# EAGLE design v1.0_r2 (EAGLE 9.6.2)
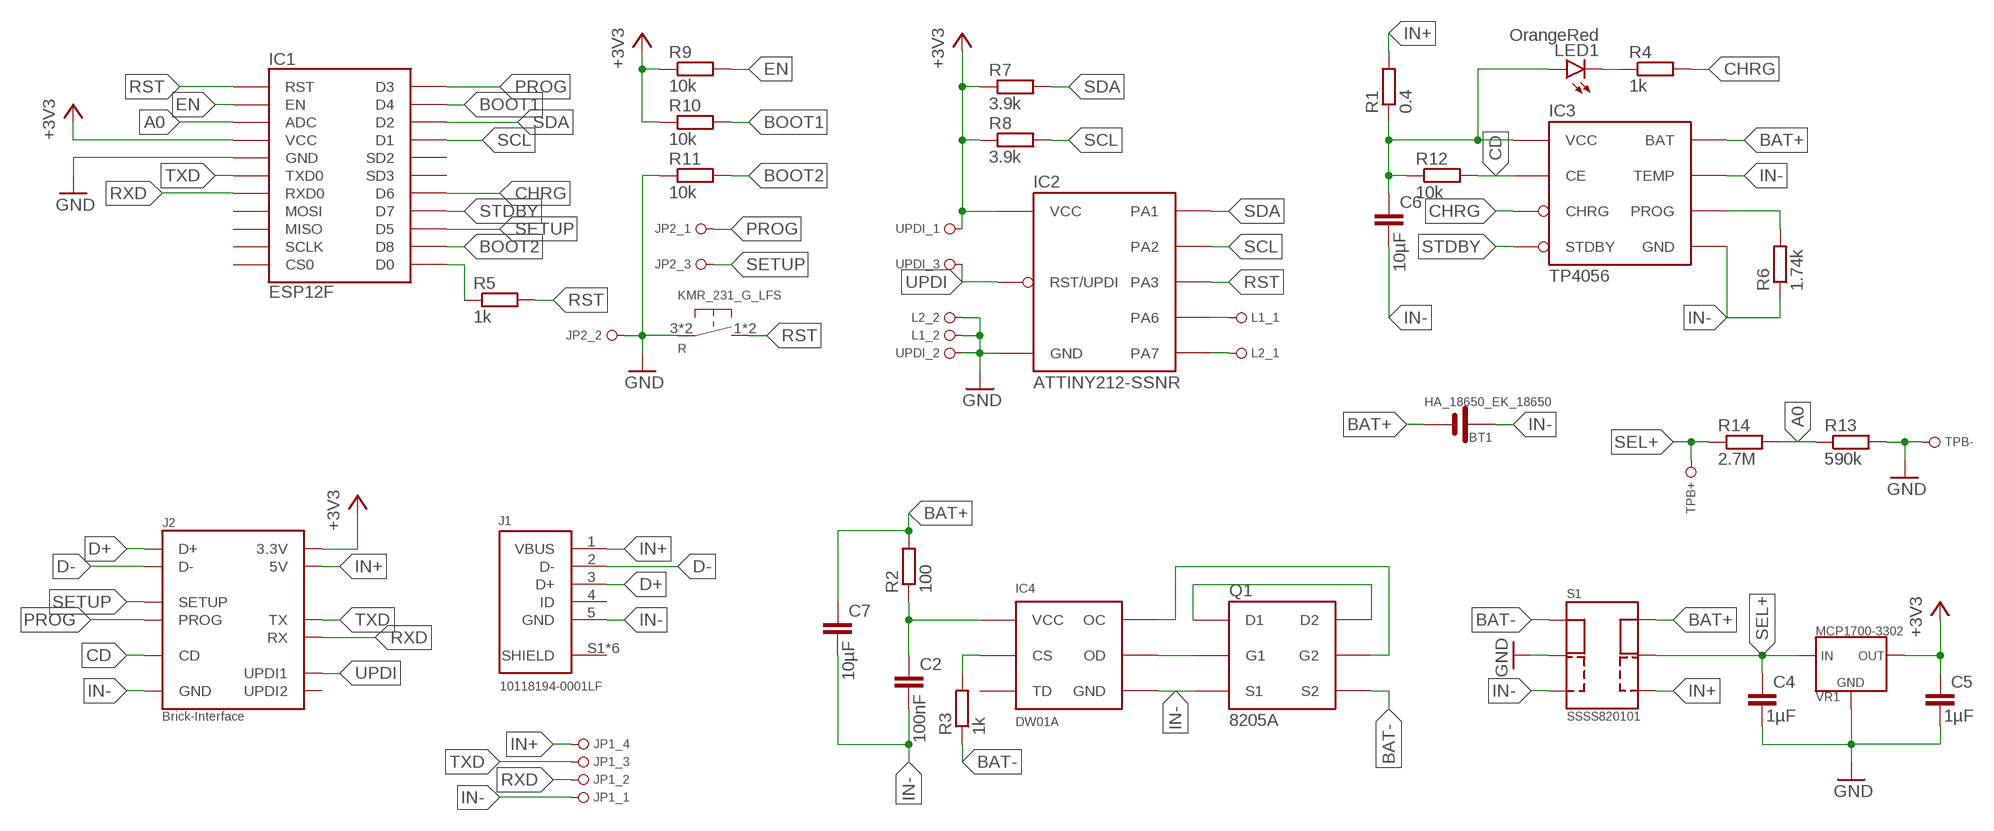
[diagram p0: schematic, sheet 1]

## Parts
BT1  HA_18650_EK_18650  [HA_18650_EK_18650]
C2  100nF  C-EUC0805  [C0805]
C4  1µF  C-EUC0805  [C0805]
C5  1µF  C-EUC0805  [C0805]
C6  10µF  C-EUC0805  [C0805]
C7  10µF  C-EUC0805  [C0805]
IC1  ESP12F  [ESP12]
IC2  ATTINY212-SSNR  [SOIC8]
IC3  TP4056  [SO8-THERMALPAD]
IC4  DW01A  [SOT23-6]
J1  10118194-0001LF  [10118194-0001LF]
J2  Brick-Interface  NAHS-BRICK-INTERFACE_B-SIDE  [500334-0160]
JP1  PINHD_1X04_R_1  [1X04_R_1]
JP2  PINHD_1X03_R_1  [1X03_R_1]
L1  PINHD_1X02_R_1  [1X02_R_1]
L2  PINHD_1X02_R_1  [1X02_R_1]
LED1  OrangeRed  LEDCHIP-LED0805  [CHIP-LED0805]
Q1  8205A  [TSSOP8]
R  KMR_231_G_LFS  [KMR_231_G_LFS]
R1  0.4  R-EU_R0805  [R0805]
R2  100  R-EU_R0805  [R0805]
R3  1k  R-EU_R0805  [R0805]
R4  1k  R-EU_R0805  [R0805]
R5  1k  R-EU_R0805  [R0805]
R6  1.74k  R-EU_R0805  [R0805]
R7  3.9k  R-EU_R0805  [R0805]
R8  3.9k  R-EU_R0805  [R0805]
R9  10k  R-EU_R0805  [R0805]
R10  10k  R-EU_R0805  [R0805]
R11  10k  R-EU_R0805  [R0805]
R12  10k  R-EU_R0805  [R0805]
R13  590k  R-EU_R0805  [R0805]
R14  2.7M  R-EU_R0805  [R0805]
S1  SSSS820101  [SSSS820101]
TPB+  PINHD_1X01_S_0.8  [1X01_S_0.8]
TPB-  PINHD_1X01_S_0.8  [1X01_S_0.8]
UPDI  PINHD_1X03_R_1  [1X03_R_1]
VR1  MCP1700-3302  [SOT23]

## Nets
+3V3: C5.1 IC1.VCC IC2.1(VCC) J2.16(3.3V) R7.1 R8.1 R9.1 R10.1 UPDI.1 VR1.2(OUT)
A0: IC1.ADC R13.1 R14.2
BAT+: BT1.P1(PLUS) BT1.P2(PLUS) BT1.P3(PLUS) C7.1 IC3.5(BAT) R2.2 S1.6
BAT-: Q1.6(S2) Q1.7(S2) R3.1 S1.3
BOOT1: IC1.GPIO2(D4) R10.2
BOOT2: IC1.GPIO15(D8) R11.2
CD: IC3.8(CE) J2.13(CD) R12.2
CHRG: IC1.GPIO12(D6) IC3.7(CHRG) R4.2
D+: J1.3(D+) J2.9(D+)
D-: J1.2(D-) J2.10(D-)
EN: IC1.EN R9.2
GND: C4.2 C5.2 IC1.GND IC2.8(GND) JP2.2 L1.2 L2.2 R11.1 R13.2 R.3 R.4 S1.2 TPB-.1 UPDI.2 VR1.1(GND)
IN+: J1.1(VBUS) J2.5(5V) J2.6(5V) JP1.4 R1.2 S1.4
IN-: BT1.M1(MINUS) BT1.M2(MINUS) BT1.M3(MINUS) C2.2 C6.2 C7.2 IC3.1(TEMP) IC3.3(GND) IC3.T1(GND) IC3.T2(GND) IC3.T3(GND) IC3.T4(GND) IC3.T5(GND) IC3.T6(GND) IC3.T7(GND) IC3.T8(GND) IC4.6(GND) J1.5(GND) J2.11(GND) J2.12(GND) JP1.1 Q1.2(S1) Q1.3(S1) R6.1 S1.1
L1: IC2.2(PA6) L1.1
L2: IC2.3(PA7) L2.1
N$1: C6.1 IC3.4(VCC) LED1.A R1.1 R12.1
N$2: IC3.2(PROG) R6.2
N$3: IC4.2(CS) R3.2
N$4: C2.1 IC4.5(VCC) R2.1
N$7: LED1.C R4.1
N$8: IC4.1(OD) Q1.4(G1)
N$10: Q1.1(D1) Q1.8(D2)
N$11: IC4.3(OC) Q1.5(G2)
PROG: IC1.GPIO0(D3) J2.1(PROG) JP2.1
RST: IC1.RST IC2.7(PA3) R5.2 R.1 R.2
RXD: IC1.RXD0 J2.7(RX) JP1.2
SCL: IC1.GPIO5(D1) IC2.5(PA2) R8.2
SDA: IC1.GPIO4(D2) IC2.4(PA1) R7.2
SEL+: C4.1 R14.1 S1.5 TPB+.1 VR1.3(IN)
SETUP: IC1.GPIO14(D5) J2.2(SETUP) JP2.3
STDBY: IC1.GPIO13(D7) IC3.6(STDBY)
TXD: IC1.TXD0 J2.8(TX) JP1.3
UPDI: IC2.6(RST/UPDI) J2.15(UPDI1) UPDI.3
WAKE: IC1.GPIO16(D0) R5.1
Unconnected: IC1.CS0 IC1.GPIO9(SD2) IC1.GPIO10(SD3) IC1.MISO IC1.MOSI IC1.SCLK IC4.4(TD) J1.4(ID) J2.14(UPDI2)

## Power pins joined to a net without a drawn wire
SHIELD: J1.S1(SHIELD) J1.S2(SHIELD) J1.S3(SHIELD) J1.S4(SHIELD) J1.S5(SHIELD) J1.S6(SHIELD)

## Library data of the parts
BT1 = no_reichelt:HA_18650_EK
C2 C4-C7 = rcl:C-EU: CAPACITOR, European symbol; SPICEPREFIX: C
IC1 = no_expressif:ESP12
IC2 = no_microchip:ATTINY212
IC3 = no_reichelt:TP4056
IC4 = no_reichelt:DW01A
J1 = no_reichelt:10118194-0001LF: CONN RCPT USB2.0 MICRO B SMD R/A Manufacturer's datasheet <https://www.amphenol-icc.com/media/wysiwyg/files/drawing/10118194.pdf?__cf_chl_jschl_tk__=1e9b4569481076e99900b246ea640525553a7b60-1588047333-0-AZhEk6D50lwOf6CdaXmV1teudqMKHMxqtb1pEtnUtu77sOc-OVRjbCmHdORomVnr0W49D2E8XkcMdJ2SdWt5rDDYIblyJz7fSv-zilM8vQKAQDC1Z9aMVORhnMgYjPDuz8XpfDLul_eaqqFpemo1xIgoZv50WTuLMwu26ci7e02s9PWvR3z1cDqm9GMGYIPwIUd9yh5-TtN_o6DbEkadC7zoJlhYZSw-VEaYzfWnBSFg_n44fbEB3slHLR2YKLSiTmh8RSwpxKUP4gER0KeVoie9w-Ibtx3oKQbsZjrsPLGSu9BzV2nf3QeoErALCQuycvY9WhQdebLIpxaon6SXufpVIIdoKZHRpjuVVlAkUIr9oSIZGQzzOWY1-dWY48jVEOvnvoxw9-xup5uFcr7XWo0>; CREATED_BY: PCBLayout.com; DIGIKEY_PARTNO: 609-4618-2-ND; MANUFACTURER: Amphenol ICC (FCI); MPN: 10118194-0001LF
J2 = no_molex:NAHS-BRICK-INTERFACE: NAHS-Brick-Interface zum Programmieren und Konfigurieren von Bricks. B-SIDE Variant ist der Verbinder auf Brick-Seite I-SIDE Variant ist der Verbinder auf Interface-Seite
JP1 = no_pinhd:PINHD_1X04; DRILL: 1mm; PADSHAPE: round
JP2 UPDI = no_pinhd:PINHD_1X03; DRILL: 1mm; PADSHAPE: round
L1 L2 = no_pinhd:PINHD_1X02; DRILL: 1mm; PADSHAPE: round
LED1 = led:LED: LED OSRAM: - CHIPLED LG R971, LG N971, LY N971, LG Q971, LY Q971, LO R971, LY R971 LH N974, LH R974 LS Q976, LO Q976, LY Q976 LO Q996 - Hyper CHIPLED LW Q18S LB Q993, LB Q99A, LB R99A - SideLED LS A670, LO A670, LY A670, LG A670, LP A670 LB A673, LV A673, LT A673, LW A673 LH A674 LY A675 LS A676, LA A676, LO A676, LY A676, LW A676 LS A679, LY A679, LG A679 - Hyper Micro SIDELED® LS Y876, LA Y876, LO Y876, LY Y876 LT Y87S - SmartLED LW L88C, LW L88S LB L89C, LB L89S, LG L890 LS L89K, LO L89K, LY L89K LS L896, LA L896, LO L896, LY L896 - TOPLED LS T670, LO T670, LY T670, LG T670, LP T670 LSG T670, LSP T670, LSY T670, LOP T670, LYG T670 LG T671, LOG T671, LSG T671 LB T673, LV T673, LT T673, LW T673 LH T674 LS T676, LA T676, LO T676, LY T676, LB T676, LH T676, LSB T676, LW T676 LB T67C, LV T67C, LT T67C, LS T67K, LO T67K, LY T67K, LW E67C LS E67B, LA E67B, LO E67B, LY E67B, LB E67C, LV E67C, LT E67C LW T67C LS T679, LY T679, LG T679 LS T770, LO T770, LY T770, LG T770, LP T770 LB T773, LV T773, LT T773, LW T773 LH T774 LS E675, LA E675, LY E675, LS T675 LS T776, LA T776, LO T776, LY T776, LB T776 LHGB T686 LT T68C, LB T68C - Hyper Mini TOPLED® LB M676 - Mini TOPLED Santana® LG M470 LS M47K, LO M47K, LY M47K Source: http://www.osram.convergy.de LUXEON: - LUMILED® LXK2-PW12-R00, LXK2-PW12-S00, LXK2-PW14-U00, LXK2-PW14-V00 LXK2-PM12-R00, LXK2-PM12-S00, LXK2-PM14-U00 LXK2-PE12-Q00, LXK2-PE12-R00, LXK2-PE12-S00, LXK2-PE14-T00, LXK2-PE14-U00 LXK2-PB12-K00, LXK2-PB12-L00, LXK2-PB12-M00, LXK2-PB14-N00, LXK2-PB14-P00, LXK2-PB14-Q00 LXK2-PR12-L00, LXK2-PR12-M00, LXK2-PR14-Q00, LXK2-PR14-R00 LXK2-PD12-Q00, LXK2-PD12-R00, LXK2-PD12-S00 LXK2-PH12-R00, LXK2-PH12-S00 LXK2-PL12-P00, LXK2-PL12-Q00, LXK2-PL12-R00 Source: www.luxeon.com KINGBRIGHT: KA-3528ASYC Source: www.kingbright.com
Q1 = no_reichelt:8205A
R = no_reichelt:KMR_231_G_LFS
R1-R14 = rcl:R-EU_: RESISTOR, European symbol; SPICEPREFIX: R
S1 = no_reichelt:SSSS820101
TPB+ TPB- = no_pinhd:PINHD_1X01; DRILL: 0.8mm; PADSHAPE: square
VR1 = no_reichelt:MCP170

## Board
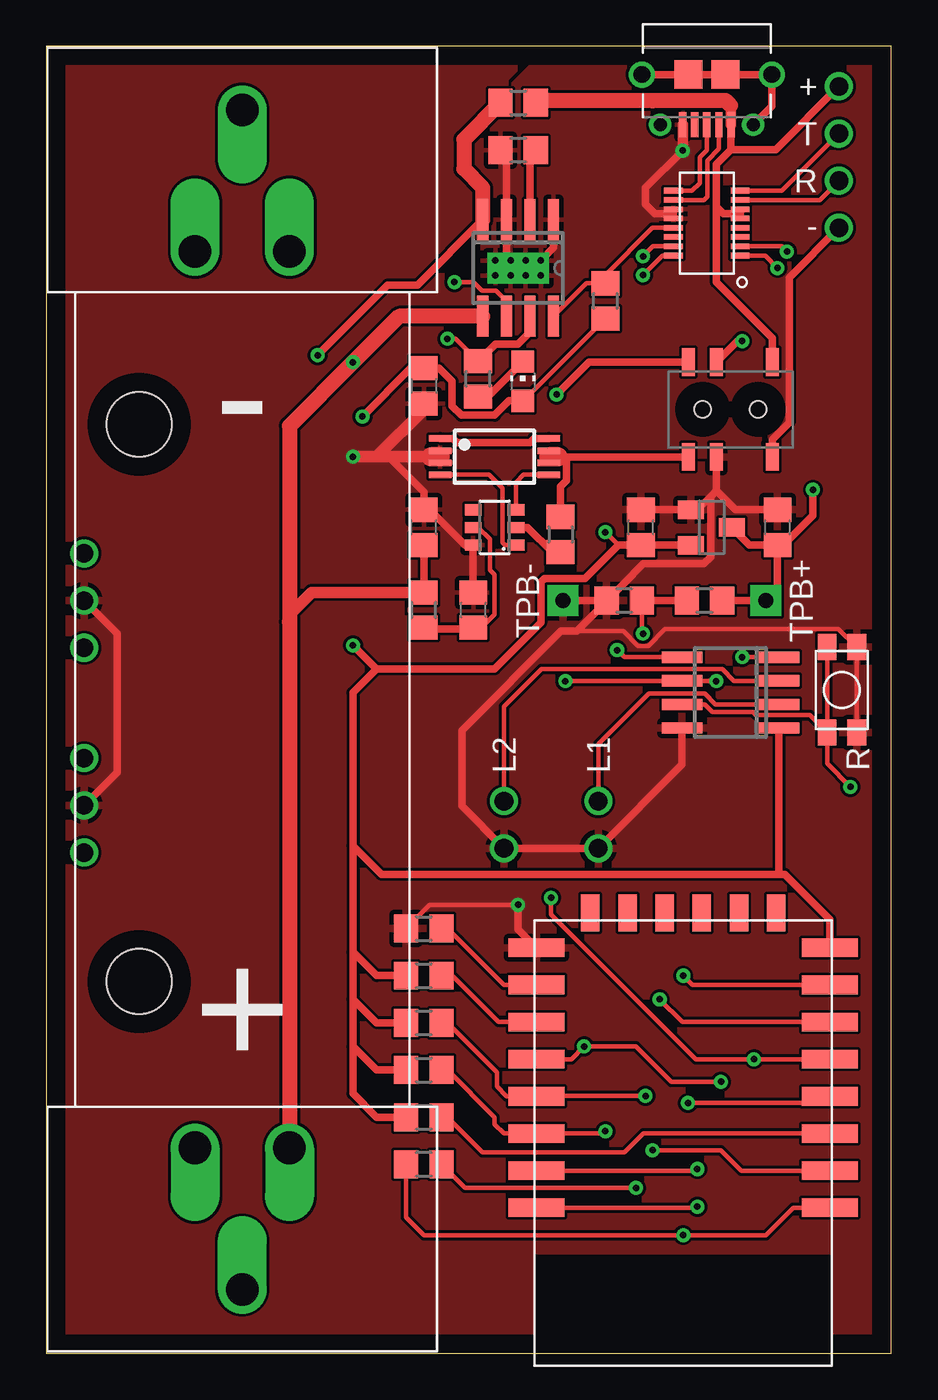
[diagram p1: board, top side]
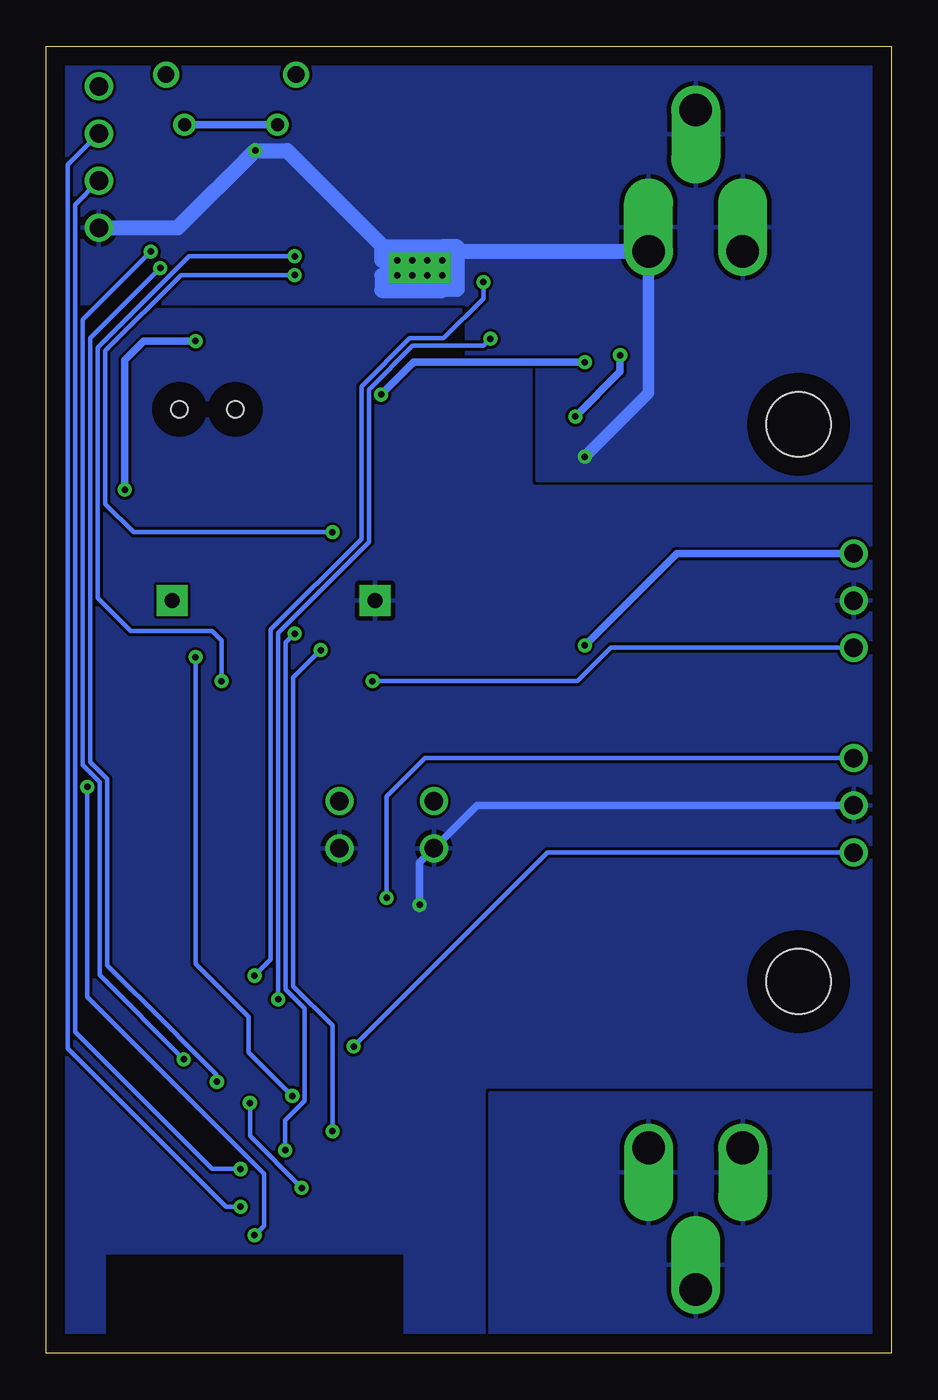
[diagram p2: board, bottom side, seen from below]

Size 45.5 x 70.35 mm. Coordinates in mm from the lower left corner, seen from the top.
Outline: 0,0 45.5,0 45.5,70.35 0,70.35 0,0
Copper layers (1*16): Top 0.035mm / dielectric 1.5mm / Bottom 0.035mm
Design rules "JLCPCB": minimum track width 6mil, minimum drill 0.3mm, track to track 6mil, track to pad 6mil, pad to pad 6mil, via to via 6mil, smd to smd 6mil, copper to edge 40mil, drill to drill 8mil, minimum pad ring 10mil, minimum via ring 8mil, stop-mask expansion 4mil, vias tented up to drill 0mil, thermal gap 10mil
Holes 3.5 mm at 5,20 5,50

### Footprints (pad centres in the part's own frame; a part is rotated, then mirrored left to right if it is on the bottom)
HA_18650_EK_18650 = drill 1.75 offset: M1 0,-30.48; M2 2.54,-22.86; M3 -2.54,-22.86; P1 0,33.02; P2 -2.54,25.4; P3 2.54,25.4
C0805 = smd 1.3 x 1.5: 1 -0.95,0; 2 0.95,0
ESP12 = smd 3 x 1: ADC -7.9,1.48; EN -7.9,-0.52; GND 7.9,-10.52; GPIO0 7.9,-4.52; GPIO2 7.9,-6.52; GPIO4 7.9,-2.52; GPIO5 7.9,-0.52; GPIO12 -7.9,-6.52; GPIO13 -7.9,-8.52; GPIO14 -7.9,-4.52; GPIO15 7.9,-8.52; GPIO16 -7.9,-2.52; RST -7.9,3.48; RXD0 7.9,1.48; TXD0 7.9,3.48; VCC -7.9,-10.52 | smd 1 x 2: CS0 -5,-12.4; GPIO9 -1,-12.4; GPIO10 1,-12.4; MISO -3,-12.4; MOSI 3,-12.4; SCLK 5,-12.4
SOIC8 = smd 0.6 x 2.2: 1 -1.905,-2.6; 2 -0.635,-2.6; 3 0.635,-2.6; 4 1.905,-2.6; 5 1.905,2.6; 6 0.635,2.6; 7 -0.635,2.6; 8 -1.905,2.6
SO8-THERMALPAD = smd 0.6 x 2.2: 1 -1.905,-2.6; 2 -0.635,-2.6; 3 0.635,-2.6; 4 1.905,-2.6; 5 1.905,2.6; 6 0.635,2.6; 7 -0.635,2.6; 8 -1.905,2.6 | drill 0.35 pad 0.813 square: T1 -1.219,0.406; T2 -0.406,0.406; T3 0.406,0.406; T4 1.219,0.406; T5 -1.219,-0.406; T6 -0.406,-0.406; T7 0.406,-0.406; T8 1.219,-0.406
SOT23-6 = smd 0.6 x 0.9: 1 -0.95,-1.15; 2 0,-1.15; 3 0.95,-1.15; 4 0.95,1.15; 5 0,1.15; 6 -0.95,1.15
10118194-0001LF = smd 0.4 x 1.35: 1 -1.3,2.7; 2 -0.65,2.7; 3 0,2.7; 4 0.65,2.7; 5 1.3,2.7 | drill 0.7: S1 -2.5,2.7; S2 2.5,2.7 | drill 0.9: S3 -3.5,0; S6 3.5,0 | smd 1.5 x 1.55: S4 -1,0; S5 1,0
500334-0160 = smd 0.3 x 1: 1 -1.75,-1.8; 2 -1.25,-1.8; 3 -0.75,-1.8; 4 -0.25,-1.8; 5 0.25,-1.8; 6 0.75,-1.8; 7 1.25,-1.8; 8 1.75,-1.8; 9 1.75,1.8; 10 1.25,1.8; 11 0.75,1.8; 12 0.25,1.8; 13 -0.25,1.8; 14 -0.75,1.8; 15 -1.25,1.8; 16 -1.75,1.8
1X04_R_1 = drill 1: 1 0,0; 2 2.54,0; 3 5.08,0; 4 7.62,0
1X03_R_1 = drill 1: 1 0,0; 2 2.54,0; 3 5.08,0
1X02_R_1 = drill 1: 1 0,0; 2 2.54,0
CHIP-LED0805 = smd 1.2 x 1.2: A 0,-1.05; C 0,1.05
TSSOP8 = smd 1.2 x 0.35: 1 -2.925,0.975; 2 -2.925,0.325; 3 -2.925,-0.325; 4 -2.925,-0.975; 5 2.925,-0.975; 6 2.925,-0.325; 7 2.925,0.325; 8 2.925,0.975
KMR_231_G_LFS = smd 1 x 1.4: 1 0,4.35; 2 0,-0.25; 3 1.6,-0.25; 4 1.6,4.35
R0805 = smd 1.3 x 1.5: 1 -0.95,0; 2 0.95,0
SSSS820101 = smd 1.5 x 0.7: 1 -2.55,-2.25; 2 -2.55,0.75; 3 -2.55,2.25; 4 2.55,-2.25; 5 2.55,0.75; 6 2.55,2.25 | hole 0.9: 0,1.5; 0,-1.5
1X01_S_0.8 = drill 0.8 pad 1.676 square: 1 0,0
SOT23 = smd 1 x 1.4: 1 -0.95,-1.1; 2 0.95,-1.1; 3 0,1.1

### Placement (x,y rotation side)
BT1  10.54,36.45 180 top
C2  22.99,40.01 90 top
C4  39.37,44.45 90 top
C5  32,44.45 90 top
C6  20.32,52.07 270 top
C7  20.32,44.45 90 top
IC1  34.29,11.3 180 top
IC2  36.83,35.56 90 top
IC3  25.4,58.42 180 top
IC4  24.13,44.45 90 top
J1  35.56,68.83 180 top
J2  35.56,60.83 90 top
JP1  42.67,60.58 90 top
JP2  2.03,26.95 90 top
L1  29.72,29.72 270 top
L2  24.64,29.72 270 top
LED1  25.65,52.32 0 top
Q1  24.13,48.26 0 top
R  42.04,33.66 0 top
R1  25.4,67.31 0 top
R2  20.32,40.01 90 top
R3  27.69,44.07 270 top
R4  23.24,52.45 90 top
R5  20.32,10.16 180 top
R6  25.4,64.77 0 top
R7  20.32,17.78 0 top
R8  20.32,15.24 0 top
R9  20.32,12.7 0 top
R10  20.32,20.32 0 top
R11  20.32,22.86 0 top
R12  30.1,56.64 90 top
R13  31.11,40.51 180 top
R14  35.43,40.51 180 top
S1  36.83,50.8 90 top
TPB+  38.73,40.51 0 top
TPB-  27.81,40.51 0 top
UPDI  2.03,43.05 270 top
VR1  35.81,44.45 270 top

### Tracks (layer width: path | path; a pad name or v marks a point on that pad's centre or on a via)
+3V3  (via drill 0.35)
  Top 0.254: J2.16 33.17,59.08 v32.13,58.04 | 30.8,43.5 v30.1,44.2
  Top 0.406: 17.78,36.83 16.51,35.56 16.51,27.3 | 17.78,36.83 24.13,36.83 26.62,39.32 26.62,41.5 26.83,41.71 29.01,41.71 30.8,43.5 C5.1 VR1.2 | 39.37,25.78 39.75,25.78 42.19,23.34 IC1.VCC | 39.37,25.78 18.03,25.78 16.51,27.3 | R9.1 17.78,12.7 16.51,13.97 16.51,16.51 | 16.51,27.3 16.51,21.59 | 16.51,21.59 16.51,19.05 | 16.51,19.05 16.51,16.51 | R8.1 17.78,15.24 16.51,16.51 | R7.1 17.78,17.78 16.51,19.05 | R10.1 17.78,20.32 16.51,21.59 | 17.78,36.83 v16.51,38.1 | IC2.1 39.43,25.84 39.37,25.78
  Bottom 0.254: v32.13,58.04 38.25,58.04 42.33,53.96 42.33,45.72 40.8,44.2 v30.1,44.2
  Bottom 0.406: v16.51,38.1 11.56,43.05 UPDI.1
A0  (via drill 0.35)
  Top 0.254: IC1.ADC 37.42,9.82 36.32,10.92 v32.64,10.92 | v32.13,38.73 32.06,38.8 R13.1
  Top 0.406: R13.1 R14.2
  Bottom 0.254: v32.64,10.92 32.64,12.53 31.6,13.57 31.6,18.56 32.61,19.57 32.61,38.25 v32.13,38.73
BAT+  (via drill 0.35)
  Top 0.406: C7.1 R2.2 | v27.48,51.6 29.22,53.35 S1.6
  Top 0.61: R2.2 14.29,40.95 13.08,39.75 13.08,39.37
  Top 0.813: IC3.5 18.99,55.82 v16.51,53.34 13.08,49.91 13.08,39.37 BT1.P2
  Bottom 0.406: v16.51,53.34 25.74,53.34 v27.48,51.6
  pour Bottom: 0,0 21.59,0 21.59,13.97 0,13.97
BAT-
  Top 0.203: Q1.7 27.05,48.26 Q1.6
  Top 0.406: R3.1 27.69,46.64 28.01,46.96 28.01,48.18 27.94,48.25 | S1.3 27.94,48.25 | 27.94,48.25 27.57,48.25 27.56,48.26
  Top 1.016: 27.56,48.26 27.05,48.26
BOOT1
  Top 0.254: R10.2 21.84,20.32 24.34,17.82 IC1.GPIO2
BOOT2
  Top 0.254: R11.2 21.59,22.86 24.63,19.82 IC1.GPIO15
CD
  Top 0.254: IC3.8 29.08,57.59 R12.2 30.1,58.04 32.64,60.58 J2.13
CHRG  (via drill 0.35)
  Top 0.254: v21.59,54.61 22.03,54.61 R4.2 | IC1.GPIO12 34.25,17.82 v33.02,19.05
  Top 0.406: IC3.7 26.04,54.97 25.4,54.33 24.17,54.33 R4.2
  Bottom 0.254: v21.59,54.61 21.97,54.23 25.78,54.23 28.13,51.88 28.13,43.66 33.02,38.78 33.02,38.1 v33.02,19.05
D+
  Top 0.254: J1.3 35.56,64.76 35.18,64.38 35.18,62.99 34.77,62.58 J2.9
D-
  Top 0.254: J1.2 36.21,64.83 35.59,64.21 35.59,62.26 35.41,62.08 J2.10
EN
  Top 0.254: R9.2 21.59,12.7 23.5,10.79 31.11,10.79 32.14,11.82 IC1.EN
GND  (via drill 0.35)
  Top 0.254: R11.1 20.64,24.13 v25.4,24.13 | 28.57,38.86 31.07,38.86 31.86,38.08 32.4,38.08 33.31,38.98 42.65,38.98 R.4 R.3
  Top 0.406: v25.4,24.13 25.4,22.81 IC1.GND | JP2.2 3.81,31.27 3.81,38.73 UPDI.2 | C5.2 VR1.1 35.05,45.4 35.77,46.12 | TPB-.1 R13.2 | R13.2 31.06,41.41 32.14,42.49 35.41,42.49 35.77,42.85 35.77,46.12 | 35.77,46.12 36.08,46.43 | C4.2 37.11,45.4 36.08,46.43 | R13.2 30.16,40.45 28.57,38.86 27.72,38.86 22.37,33.51 22.37,29.45 L2.2 L1.2 34.23,31.69 IC2.8 | S1.2 36.08,46.43
  Bottom 0.406: v25.4,24.13 25.4,26.42 L2.2 22.33,29.49 JP2.2
  pour Top (rank 2): 0,0 45.5,0 45.5,70.35 0,70.35
  pour Bottom (rank 2): 0,0 45.5,0 45.5,70.35 0,70.35
IN+
  Top 0.254: J2.6 37.36,61.34 J2.5
  Top 0.406: J1.1 36.86,64.8 | 36.86,64.8 36.07,64.01 36.07,61.72 | 36.07,61.72 36.45,61.34 37.36,61.34 | 36.86,64.8 39.27,64.8 JP1.4 | S1.4 39.08,54.65 36.07,57.66 36.07,61.72
  Top 0.559: J1.1 36.86,67.15 36.83,67.18
  Top 0.813: 36.83,67.18 36.58,67.44 32.67,67.44 32.65,67.41 26.45,67.41 R1.2
IN-  (via drill 0.35)
  Top 0.254: Q1.2 21.2,48.26 Q1.3 | J2.11 33.76,61.34 J2.12
  Top 0.406: R6.1 24.77,64.45 IC3.3 24.77,59.05 IC3.T7 | 17.78,48.26 18.41,48.26 20.32,46.35 C7.2 20.64,45.4 22.54,43.5 IC4.6 C2.2 | IC3.T7 IC3.T6 IC3.T5 27.3,59.51 IC3.1 | IC3.T7 IC3.T8 IC3.T4 IC3.T3 IC3.T2 IC3.T1 | v34.26,64.74 32.26,62.74 32.26,61.85 32.77,61.34 33.76,61.34 | S1.1 39.08,49.19 40,50.11 40,57.91 JP1.1
  Top 0.559: J1.5 v34.26,64.74
  Top 0.61: v16.51,48.26 17.78,48.26 | C6.2 20.32,50.8 17.78,48.26 | 20.7,48.26 17.78,48.26
  Top 1.016: 21.2,48.26 20.7,48.26
  Bottom 0.61: BT1.M3 13.08,51.69 v16.51,48.26
  Bottom 0.813: IC3.T3 24.99,57.21 | 24.99,57.21 24.18,57.21 IC3.T4 24.18,57.28 23.37,57.28 23.37,58.83 | IC3.T2 25.81,57.21 | 25.81,57.21 24.99,57.21 | IC3.T1 27.43,58.01 27.43,57.21 25.81,57.21 | IC3.T8 24.18,59.56 | 24.18,59.56 23.37,59.56 23.37,58.83 | IC3.T7 24.99,59.56 | 24.99,59.56 24.18,59.56 | IC3.T6 25.81,59.56 | 25.81,59.56 24.99,59.56 | 25.81,59.56 27.43,59.56 27.43,58.83 IC3.T5 32.53,64.74 v34.26,64.74 38.42,60.58 JP1.1 | IC3.T8 23.37,58.83 | IC3.T8 23.7,59.31 BT1.M3
  pour Top: 24.13,67.31 22.86,66.04 22.86,63.5 23.5,62.87 23.5,60.96 23.5,56.52 22.86,55.88 19.05,55.88 13.97,50.8 13.21,50.04 13.21,40.89 19.56,40.89 19.56,38.99 23.37,38.99 24.13,39.75 24.13,40.26 24.13,43.18 24.51,43.56 28.07,43.56 28.07,48.26 36.07,48.26 36.07,48.77 36.2,48.9 38.99,48.9 38.99,49.15 40.01,50.16 40.01,59.18 39.88,59.31 39.62,59.56 37.59,59.56 37.59,62.48 36.07,62.48 36.07,64.01 36.96,64.9 39.5,64.9 43.18,68.58 43.18,70.36 27.18,70.36
  pour Bottom: 0,70.35 0,46.99 19.05,46.99 19.05,53.34 22.86,53.34 22.86,56.52 27.56,56.52 45.5,56.52 45.5,70.35
L1
  Top 0.254: L1.1 29.72,31.75 29.72,32.26 29.72,32.78 32.44,35.5 35.45,35.5 36.02,34.92 IC2.2
L2
  Top 0.254: IC2.3 37.02,36.2 36.39,36.83 26.67,36.83 24.64,34.8 L2.1
N$1  (via drill 0.35)
  Top 0.254: R12.1 25.68,51.27 LED1.A
  Top 0.406: IC3.4 19.97,57.5 18.38,57.5 v14.61,53.72 | LED1.A 24.92,51.27 24.14,50.49 22.34,50.49 21.84,50.99 21.84,52.32 21.15,53.02 C6.1 19.62,53.02 v17.02,50.42
  Top 0.813: R1.1 22.48,65.34 22.48,63.75 23.5,62.74 IC3.4
  Bottom 0.406: v14.61,53.72 14.61,52.83 v17.02,50.42
N$2
  Top 0.406: R6.2 26.04,64.45 IC3.2
N$3
  Top 0.406: IC4.2 25.91,44.45 27.24,43.12 R3.2
N$4
  Top 0.254: IC4.5 23.24,44.45 23.88,43.81 23.88,42.16 24.13,41.91 24.13,39.75 23.43,39.05 C2.1
  Top 0.406: R2.1 20.39,38.99 22.92,38.99 C2.1
N$7
  Top 0.406: R4.1 23.78,51.5 LED1.C
N$8
  Top 0.254: Q1.4 23.84,47.28 24.55,46.57 24.55,44.45 24.55,44.03 24.55,43.65 24.7,43.5 IC4.1
N$10
  Top 0.406: Q1.1 21.89,49.23 22.1,49.02 26.04,49.02 26.25,49.23 Q1.8
N$11
  Top 0.254: Q1.5 25.7,47.28 25.28,46.87 IC4.3
PROG  (via drill 0.35)
  Top 0.254: IC1.GPIO0 28.27,15.82 v28.96,16.51 31.75,16.51 33.66,14.61 v36.32,14.61 | J2.1 38.71,59.08 v39.37,58.42
  Bottom 0.254: v28.96,16.51 18.52,26.95 JP2.1 | v39.37,58.42 43.14,54.65 43.14,31.83 42.23,30.92 42.23,20.88 40.74,19.39 40.52,19.17 36.32,14.97 v36.32,14.61
RST  (via drill 0.35)
  Top 0.254: IC1.RST 40.21,7.82 38.73,6.35 v34.29,6.35 20.32,6.35 19.37,7.3 R5.2 | R.1 R.2 | R.2 42.04,31.74 v43.29,30.48 | IC2.7 35.45,34.92 35.86,34.52 38.04,34.52 38.21,34.35 41.1,34.35 R.2
  Bottom 0.254: v34.29,6.35 33.78,6.86 33.78,9.65 35.43,11.3 43.29,19.16 v43.29,30.48
RXD  (via drill 0.35)
  Top 0.254: IC1.RXD0 34.97,9.82 v35.05,9.91 | JP1.2 41.64,62.08 J2.7
  Bottom 0.254: v35.05,9.91 36.58,9.91 43.95,17.28 43.95,61.84 JP1.2
SCL  (via drill 0.35)
  Top 0.254: v30.1,11.94 29.98,11.82 IC1.GPIO5 24.63,11.82 24.13,12.32 24.13,12.7 21.59,15.24 R8.2 | v30.73,37.85 31.11,37.47 IC2.5
  Bottom 0.254: v30.1,11.94 30.1,17.63 32.21,19.74 32.21,36.37 v30.73,37.85
SDA  (via drill 0.35)
  Top 0.254: v32.26,13.84 26.41,13.84 IC1.GPIO4 24.79,13.82 24.26,14.35 24.26,15.11 21.59,17.78 R7.2 | IC2.4 v37.47,37.47
  Bottom 0.254: v32.26,13.84 34.61,16.19 34.61,18.1 37.47,20.95 v37.47,37.47
SEL+  (via drill 0.35)
  Top 0.406: C4.1 39.37,41.15 TPB+.1 R14.1 | C4.1 37.86,43.5 VR1.3 | S1.5 37.21,54.48 v37.47,54.48 | v41.27,46.48 41.27,45.09 39.69,43.5 C4.1
  Bottom 0.406: v37.47,54.48 40.26,54.48 41.27,53.47 v41.27,46.48
SETUP  (via drill 0.35)
  Top 0.254: v27.18,24.51 27.18,23.62 34.98,15.82 v38.1,15.82 IC1.GPIO14 | J2.2 39.6,59.58 v39.88,59.31
  Bottom 0.254: v39.88,59.31 43.54,55.64 43.54,31.66 42.63,30.75 42.63,20.36 v38.1,15.82 | v27.18,24.51 27.18,29.97 25.12,32.03 JP2.3
SHIELD
  Top 0.406: J1.S6 J1.S5 J1.S4 J1.S3 39.06,67.13 J1.S1
  Bottom 0.406: J1.S1 J1.S2
STDBY  (via drill 0.35)
  Top 0.254: v21.97,57.66 22.99,57.66 23.45,57.2 24.21,57.2 24.77,56.64 IC3.6 | IC1.GPIO13 34.79,19.82 v34.29,20.32
  Bottom 0.254: v21.97,57.66 21.97,56.77 24.11,54.63 25.4,54.63 25.95,54.63 28.54,52.05 28.54,43.83 33.43,38.94 33.43,36.83 33.43,21.18 v34.29,20.32
TXD  (via drill 0.35)
  Top 0.254: IC1.TXD0 35,7.82 v35.05,7.87 | JP1.3 39.6,62.58 J2.8
  Bottom 0.254: v35.05,7.87 35.81,7.87 44.36,16.42 44.36,63.97 JP1.3
UPDI  (via drill 0.35)
  Top 0.254: J2.15 32.66,59.58 v32.13,59.05 | v36.07,36.17 36.05,36.2 IC2.6 27.96,36.2 v27.94,36.17
  Bottom 0.254: UPDI.3 15.11,37.97 16.91,36.17 v27.94,36.17 | v32.13,59.05 37.8,59.05 42.73,54.13 42.73,40.64 40.95,38.86 36.58,38.86 36.07,38.35 v36.07,36.17
WAKE  (via drill 0.35)
  Top 0.254: IC1.GPIO16 41.83,13.46 v34.54,13.46 | v31.75,8.89 22.54,8.89 R5.1
  Bottom 0.254: v34.54,13.46 34.54,11.68 v31.75,8.89

### Text on the board
tNames: + | T | R | -
tDocu: BAT | USB | by NiJO's | + | - | U | NAHS-LatchBrick | S | P | v1.0 R2
bDocu: by NiJO's | NAHS-LatchBrick | v1.0 R2